# EAGLE design Addon - out8 16A - energy storage - 4TE - MID (EAGLE 6.3)
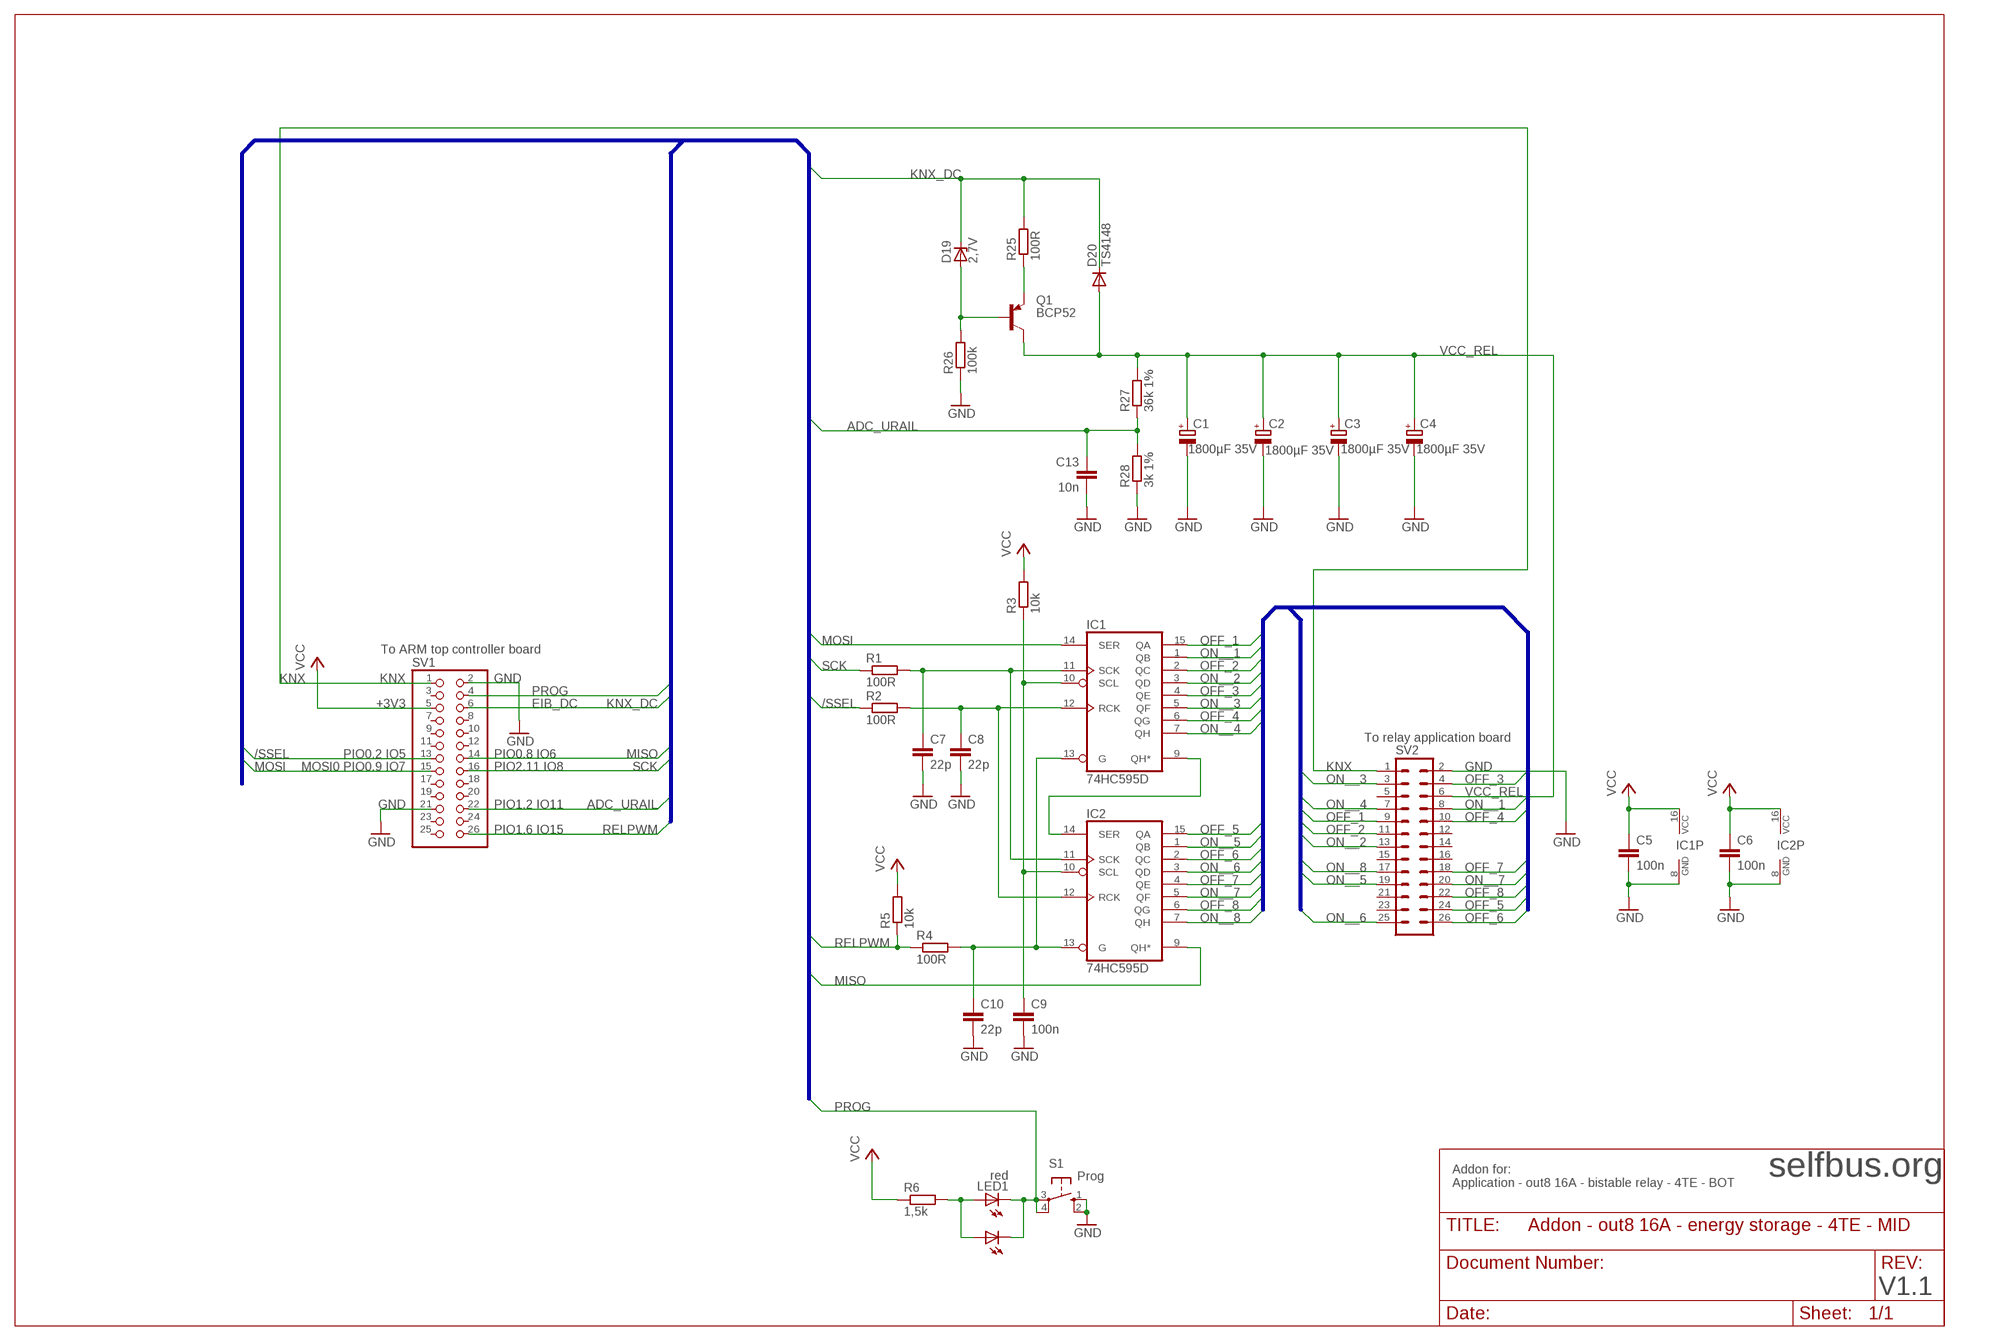
[diagram p0: schematic, sheet 1]

## Parts
C1  1800µF 35V  CPOL-EUE5-13-30  [E5-13-30]
C2  1800µF 35V  CPOL-EUE5-13-30  [E5-13-30]
C3  1800µF 35V  CPOL-EUE5-13-30  [E5-13-30]
C4  1800µF 35V  CPOL-EUE5-13-30  [E5-13-30]
C5  100n  C-EUC0805M  [R0805M]
C6  100n  C-EUC0805M  [R0805M]
C7  22p  C-EUC0805M  [R0805M]
C8  22p  C-EUC0805M  [R0805M]
C9  100n  C-EUC0805M  [R0805M]
C10  22p  C-EUC0805M  [R0805M]
C13  10n  C-EUC0805M  [R0805M]
D19  2,7V  ZENER-DIODESOT23  [SOT23]
D20  TS4148  DIODE-D0805  [D0805]
IC1  74HC595D  [SO16]
IC2  74HC595D  [SO16]
LED1  red  LED3MM  [LED3MM]
LED2  LG_T679-E1F1-1  [PLCC2]
Q1  BCP52  FZT753SMD  [SOT223]
R1  100R  R-EU_R0805M  [R0805M]
R2  100R  R-EU_R0805M  [R0805M]
R3  10k  R-EU_R0805M  [R0805M]
R4  100R  R-EU_R0805M  [R0805M]
R5  10k  R-EU_R0805M  [R0805M]
R6  1,5k  R-EU_R0805M  [R0805M]
R25  100R  R-EU_R0805M  [R0805M]
R26  100k  R-EU_R0805M  [R0805M]
R27  36k 1%  R-EU_R0805M  [R0805M]
R28  3k 1%  R-EU_R0805M  [R0805M]
S1  Prog  10-XX  [B3F-10XX]
SV1  B  PINHD-2X13SMD  [2X13SMD]
SV2  A  ML26  [ML26]

## Nets
/SSEL: R2.1 SV1.13
ADC_URAIL: C13.1 R27.1 R28.2 SV1.22
GND: C1.- C2.- C3.- C4.- C5.2 C6.2 C7.2 C8.2 C9.2 C10.2 C13.2 IC1.8(GND) IC2.8(GND) R26.1 R28.1 S1.1(S) S1.2(S1) SV1.2 SV1.21 SV2.2
KNX: SV1.1 SV2.1
KNX_DC: D19.3(C) D20.C R25.2 SV1.6
MISO: IC2.9(QH*) SV1.14
MOSI: IC1.14(SER) SV1.15
N$1: D19.1(A) Q1.1(B) R26.2
N$2: IC1.9(QH*) IC2.14(SER)
N$3: C7.1 IC1.11(SCK) IC2.11(SCK) R1.2
N$4: C8.1 IC1.12(RCK) IC2.12(RCK) R2.2
N$5: LED1.A LED2.A R6.2
N$6: Q1.3(E) R25.1
N$7: C10.1 IC1.13(G) IC2.13(G) R4.2
N$37: C9.1 IC1.10(SCL) IC2.10(SCL) R3.1
OFF_1: IC1.15(QA) SV2.9
OFF_2: IC1.2(QC) SV2.11
OFF_3: IC1.4(QE) SV2.4
OFF_4: IC1.6(QG) SV2.10
OFF_5: IC2.15(QA) SV2.24
OFF_6: IC2.2(QC) SV2.26
OFF_7: IC2.4(QE) SV2.18
OFF_8: IC2.6(QG) SV2.22
ON__1: IC1.1(QB) SV2.8
ON__2: IC1.3(QD) SV2.13
ON__3: IC1.5(QF) SV2.3
ON__4: IC1.7(QH) SV2.7
ON__5: IC2.1(QB) SV2.19
ON__6: IC2.3(QD) SV2.25
ON__7: IC2.5(QF) SV2.20
ON__8: IC2.7(QH) SV2.17
PROG: LED1.K(C) LED2.C S1.3(P) S1.4(P1) SV1.4
RELPWM: R4.1 R5.1 SV1.26
SCK: R1.1 SV1.16
VCC: C5.1 C6.1 IC1.16(VCC) IC2.16(VCC) R3.2 R5.2 R6.1 SV1.5
VCC_REL: C1.+ C2.+ C3.+ C4.+ D20.A Q1.2(C) Q1.4(C) R27.2 SV2.6
Unconnected: SV1.3 SV1.7 SV1.8 SV1.9 SV1.10 SV1.11 SV1.12 SV1.17 SV1.18 SV1.19 SV1.20 SV1.23 SV1.24 SV1.25 SV2.5 SV2.12 SV2.14 SV2.15 SV2.16 SV2.21 SV2.23

## Buses
ON__[1..8],OFF_[1..8]
/SSEL,ADC_URAIL,KNX_DC,MISO,MOSI,PROG,RELPWM,SCK

## Notes on the sheet
- To ARM top controller board
- KNX | GND
- +3V3 | EIB_DC
- To relay application board
- PIO0.2 IO5 | PIO0.8 IO6
- MOSI0 PIO0.9 IO7 | PIO2.11 IO8
- GND | PIO1.2 IO11
- PIO1.6 IO15
- selfbus.org
- Addon for:
  Application - out8 16A - bistable relay - 4TE - BOT
- V1.1

## Library data of the parts
C1-C4 = rcl:CPOL-EU: POLARIZED CAPACITOR, European symbol
C5-C10 C13 = rcl:C-EU: CAPACITOR, European symbol
D19 = diode:ZENER-DIODE: Z-Diode
D20 = diode:DIODE-: DIODE
IC1 IC2 = 74xx-eu:74*595: 8-bit SHIFT REGISTER, output latch
LED1 = led:LED: LED OSRAM: - CHIPLED LG R971, LG N971, LY N971, LG Q971, LY Q971, LO R971, LY R971 LH N974, LH R974 LS Q976, LO Q976, LY Q976 LO Q996 - Hyper CHIPLED LW Q18S LB Q993, LB Q99A, LB R99A - SideLED LS A670, LO A670, LY A670, LG A670, LP A670 LB A673, LV A673, LT A673, LW A673 LH A674 LY A675 LS A676, LA A676, LO A676, LY A676, LW A676 LS A679, LY A679, LG A679 - Hyper Micro SIDELED® LS Y876, LA Y876, LO Y876, LY Y876 LT Y87S - SmartLED LW L88C, LW L88S LB L89C, LB L89S, LG L890 LS L89K, LO L89K, LY L89K LS L896, LA L896, LO L896, LY L896 - TOPLED LS T670, LO T670, LY T670, LG T670, LP T670 LSG T670, LSP T670, LSY T670, LOP T670, LYG T670 LG T671, LOG T671, LSG T671 LB T673, LV T673, LT T673, LW T673 LH T674 LS T676, LA T676, LO T676, LY T676, LB T676, LH T676, LSB T676, LW T676 LB T67C, LV T67C, LT T67C, LS T67K, LO T67K, LY T67K, LW E67C LS E67B, LA E67B, LO E67B, LY E67B, LB E67C, LV E67C, LT E67C LW T67C LS T679, LY T679, LG T679 LS T770, LO T770, LY T770, LG T770, LP T770 LB T773, LV T773, LT T773, LW T773 LH T774 LS E675, LA E675, LY E675, LS T675 LS T776, LA T776, LO T776, LY T776, LB T776 LHGB T686 LT T68C, LB T68C - Hyper Mini TOPLED® LB M676 - Mini TOPLED Santana® LG M470 LS M47K, LO M47K, LY M47K Source: http://www.osram.convergy.de LUXEON: - LUMILED® LXK2-PW12-R00, LXK2-PW12-S00, LXK2-PW14-U00, LXK2-PW14-V00 LXK2-PM12-R00, LXK2-PM12-S00, LXK2-PM14-U00 LXK2-PE12-Q00, LXK2-PE12-R00, LXK2-PE12-S00, LXK2-PE14-T00, LXK2-PE14-U00 LXK2-PB12-K00, LXK2-PB12-L00, LXK2-PB12-M00, LXK2-PB14-N00, LXK2-PB14-P00, LXK2-PB14-Q00 LXK2-PR12-L00, LXK2-PR12-M00, LXK2-PR14-Q00, LXK2-PR14-R00 LXK2-PD12-Q00, LXK2-PD12-R00, LXK2-PD12-S00 LXK2-PH12-R00, LXK2-PH12-S00 LXK2-PL12-P00, LXK2-PL12-Q00, LXK2-PL12-R00 Source: www.luxeon.com KINGBRIGHT: KA-3528ASYC Source: www.kingbright.com
LED2 = led:*_T679-?-1: LC TOPLED® Low Current LED Source: http://catalog.osram-os.com .. LG_LS_LY_T679_OBS.pdf; COLOR: green
Q1 = transistor-pnp:FZT753SMD: PNP Transistor
R1-R6 R25-R28 = rcl:R-EU_: RESISTOR, European symbol
S1 = switch-omron:10-XX: OMRON SWITCH
SV1 = pinhead:PINHD-2X13: PIN HEADER
SV2 = con-harting-ml:ML26: HARTING; OC_FARNELL: unknown; OC_NEWARK: unknown

## Board
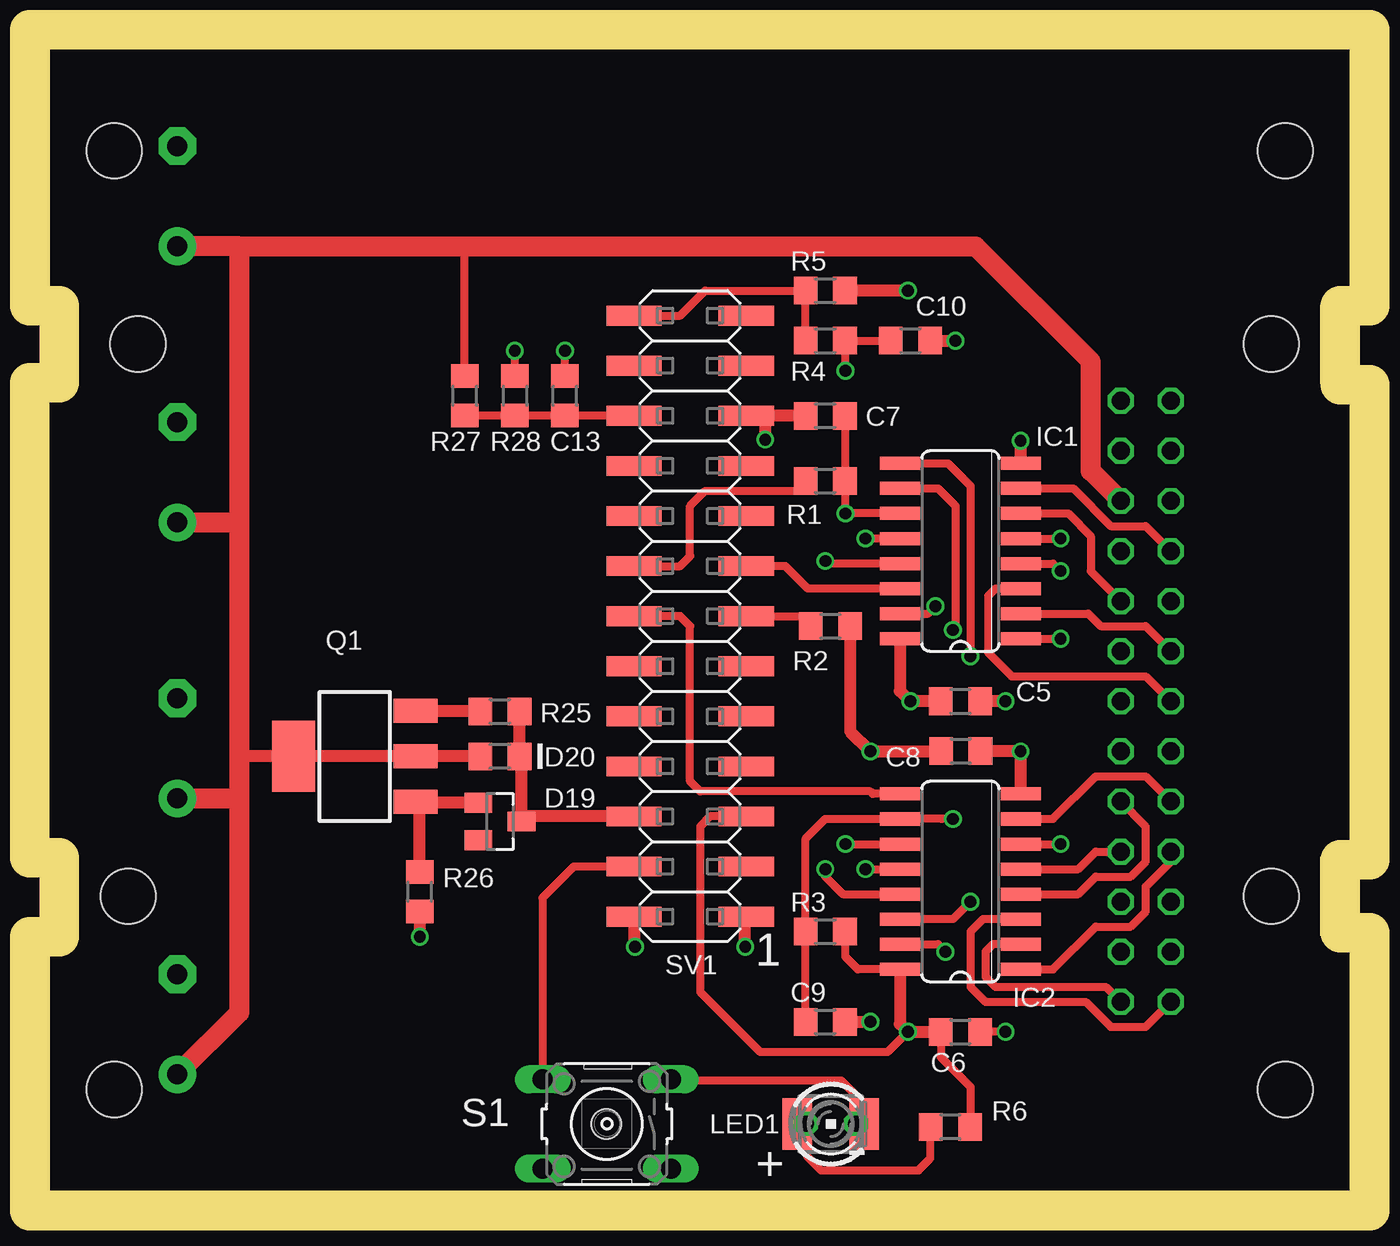
[diagram p1: board, top side]
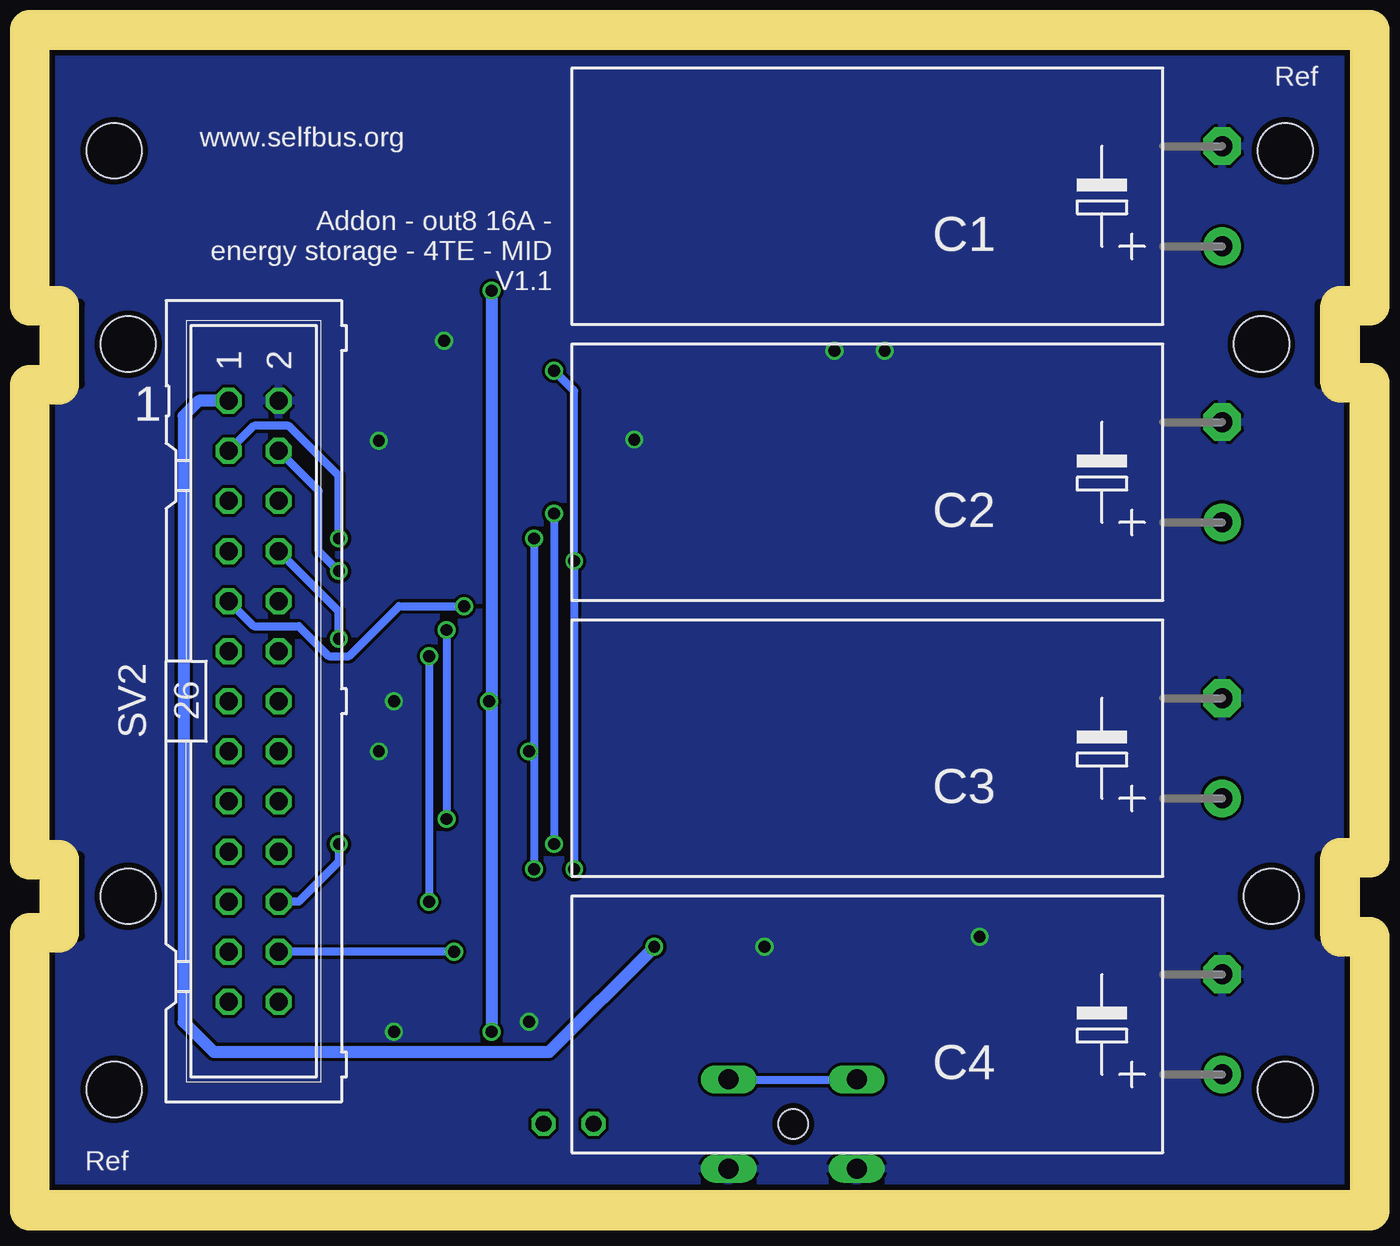
[diagram p2: board, bottom side, seen from below]

Size 66 x 57.9 mm. Coordinates in mm from the lower left corner, seen from the top.
Outline: 0,0 66,0 66,12.95 64.5,12.95 64.5,16.95 66,16.95 66,40.95 64.5,40.95 64.5,44.95 66,44.95 66,57.9 0,57.9 0,44.95 1.5,44.95 1.5,40.95 0,40.95 0,16.95 1.5,16.95 1.5,12.95 0,12.95 0,0
Copper layers (1*16): Top 0.035mm / dielectric 1.5mm / Bottom 0.035mm
Design rules "default": minimum track width 0.16mm, minimum drill 0.3mm, track to track 0.16mm, track to pad 0.16mm, pad to pad 0.16mm, via to via 0.16mm, smd to smd 0.16mm, copper to edge 0.3mm, drill to drill 0.2mm, minimum pad ring 0.2mm, minimum via ring 0.15mm, stop-mask expansion 0.075mm, vias tented up to drill 12mil, thermal gap 0.15mm
Holes 2.8 mm at 62.7,52.75 3.3,52.75 3.3,5.15 62.7,5.15 4,14.95 4.5,42.95 62,42.95 62,14.95
Holes 1.5 mm at 28.27,3.4
Milling: 20 lines

### Footprints (pad centres in the part's own frame; a part is rotated, then mirrored left to right if it is on the bottom)
E5-13-30 = drill 1.016 pad 1.905: + -2.54,0 | drill 1.016 pad 1.905 octagon: - 2.54,0
R0805M = smd 1.2 x 1.4: 1 -1,0; 2 1,0
SOT23 = smd 1 x 1.4: 1 -0.95,-1.1; 2 0.95,-1.1; 3 0,1.1
D0805 = smd 1.2 x 1.4: A 1,0; C -1,0
SO16 = smd 0.66 x 2.032: 1 -4.445,-3.073; 2 -3.175,-3.073; 3 -1.905,-3.073; 4 -0.635,-3.073; 5 0.635,-3.073; 6 1.905,-3.073; 7 3.175,-3.073; 8 4.445,-3.073; 9 4.445,3.073; 10 3.175,3.073; 11 1.905,3.073; 12 0.635,3.073; 13 -0.635,3.073; 14 -1.905,3.073; 15 -3.175,3.073; 16 -4.445,3.073
LED3MM = drill 0.813 octagon: A -1.27,0; K 1.27,0
PLCC2 = smd 2.6 x 1.5: A 0,1.7; C 0,-1.7
SOT223 = smd 1.219 x 2.235: 1 -2.311,-3.099; 2 0,-3.099; 3 2.311,-3.099 | smd 3.6 x 2.2: 4 0,3.099
B3F-10XX = drill 1.016 long: 1 -3.251,2.261; 2 3.251,2.261; 3 -3.251,-2.261; 4 3.251,-2.261
2X13SMD = smd 1 x 2.8: 1 -15.24,-2.85; 2 -15.24,2.85; 3 -12.7,-2.85; 4 -12.7,2.85; 5 -10.16,-2.85; 6 -10.16,2.85; 7 -7.62,-2.85; 8 -7.62,2.85; 9 -5.08,-2.85; 10 -5.08,2.85; 11 -2.54,-2.85; 12 -2.54,2.85; 13 0,-2.85; 14 0,2.85; 15 2.54,-2.85; 16 2.54,2.85; 17 5.08,-2.85; 18 5.08,2.85; 19 7.62,-2.85; 20 7.62,2.85; 21 10.16,-2.85; 22 10.16,2.85; 23 12.7,-2.85; 24 12.7,2.85; 25 15.24,-2.85; 26 15.24,2.85
ML26 = drill 0.914 octagon: 1 -15.24,-1.27; 2 -15.24,1.27; 3 -12.7,-1.27; 4 -12.7,1.27; 5 -10.16,-1.27; 6 -10.16,1.27; 7 -7.62,-1.27; 8 -7.62,1.27; 9 -5.08,-1.27; 10 -5.08,1.27; 11 -2.54,-1.27; 12 -2.54,1.27; 13 0,-1.27; 14 0,1.27; 15 2.54,-1.27; 16 2.54,1.27; 17 5.08,-1.27; 18 5.08,1.27; 19 7.62,-1.27; 20 7.62,1.27; 21 10.16,-1.27; 22 10.16,1.27; 23 12.7,-1.27; 24 12.7,1.27; 25 15.24,-1.27; 26 15.24,1.27

### Placement (x,y rotation side)
C1  6.5,50.45 90 bottom
C2  6.5,36.45 90 bottom
C3  6.5,22.45 90 bottom
C4  6.5,8.45 90 bottom
C5  46.23,24.83 0 top
C6  46.23,8.07 0 top
C7  39.37,39.31 180 top
C8  46.24,22.32 0 top
C9  39.37,8.58 0 top
C10  43.69,43.12 0 top
C13  26.16,40.33 90 top
D19  22.86,18.74 270 top
D20  22.86,22.04 180 top
IC1  46.23,32.45 90 top
IC2  46.23,15.69 90 top
LED1  39.65,3.4 0 top
LED2  39.65,3.4 90 top
Q1  15.49,22.04 90 top
R1  39.37,36.01 0 top
R2  39.62,28.64 0 top
R3  39.37,13.15 0 top
R4  39.37,43.12 0 top
R5  39.37,45.66 0 top
R6  45.72,3.24 180 top
R25  22.86,24.33 0 top
R26  18.8,15.18 90 top
R27  21.08,40.33 90 top
R28  23.62,40.33 270 top
S1  28.29,3.4 180 top
SV1  32.51,29.15 90 top
SV2  55.63,24.83 270 bottom

### Tracks (layer width: path | path; a pad name or v marks a point on that pad's centre or on a via)
/SSEL
  Top 0.406: SV1.13 38.12,29.15 R2.1
ADC_URAIL
  Top 0.406: SV1.22 26.18,39.31 | 26.18,39.31 C13.1 | 26.18,39.31 23.64,39.31 R28.2 R27.1
GND  (via drill 0.6)
  Top 0.406: R28.1 v23.62,42.61 | C13.2 v26.16,42.61 | v48.51,8.07 C6.2
  Top 0.61: C9.2 v41.66,8.58 | SV1.2 29.66,12.44 v29.72,12.39 | C8.2 49.25,22.32 v49.28,22.29 49.28,20.16 IC2.8 | C10.2 v45.97,43.12 | v36.32,38.1 36.32,39.06 36.07,39.31 | 36.07,39.31 SV1.21 | R26.1 v18.8,12.9 | C7.2 36.07,39.31 | v48.51,24.83 C5.2 | IC1.8 49.3,38.02 v49.28,38.04
  pour Bottom: 0,-0.06 66.04,-0.06 66.04,58.11 0,58.11
KNX  (via drill 0.6)
  Top 0.61: v35.31,12.39 35.31,13.86 SV1.1
  Bottom 0.61: SV2.1 58.42,40.07 59.18,39.31 59.18,8.58 57.66,7.05 40.64,7.05 v35.31,12.39
KNX_DC
  Top 0.61: SV1.6 24.21,18.99 D19.3 23.96,21.94 D20.C R25.2
MISO
  Top 0.406: 43.18,20.16 IC2.9 41.78,20.14 41.66,20.26 33.02,20.26 32.51,20.77 32.51,28.64 32,29.15 SV1.14
MOSI
  Top 0.406: IC1.14 38.48,30.55 37.34,31.69 SV1.15
N$1
  Top 0.61: D19.1 18.63,19.69 Q1.1 18.8,19.52 R26.2
N$2  (via drill 0.6)
  Top 0.406: IC1.9 45.59,36.9 46.74,35.76 v46.74,27.12 | IC2.14 45.85,13.79 v46.74,14.67
  Bottom 0.406: v46.74,27.12 v46.74,14.67
N$3  (via drill 0.6)
  Top 0.406: IC1.11 v40.39,34.36 40.37,34.38 R1.2 C7.1 | v40.39,17.59 IC2.11
  Bottom 0.406: v40.39,34.36 v40.39,17.59
N$4  (via drill 0.6)
  Top 0.406: IC1.12 v41.4,33.09 | v41.4,16.32 IC2.12
  Top 0.61: R2.2 40.62,23.33 v41.66,22.29 45.22,22.29 C8.1
  Bottom 0.406: v41.4,33.09 41.4,22.29 | 41.4,22.29 v41.4,16.32 | v41.66,22.29 41.4,22.29
N$5
  Top 0: LED2.A 37.95,3.35 38.4,2.91 38.4,3.2 38.45,3.25
  Top 0.406: LED1.A 38.4,2.91 | 44.7,3.23 R6.2 44.7,3.22 44.7,1.65 44.1,1.05 39.15,1.05 38.45,1.75 38.45,3.25
N$6
  Top 0.61: R25.1 18.62,24.33 Q1.3
N$7  (via drill 0.6)
  Top 0.406: v39.37,16.32 39.37,15.94 40.26,15.05 IC2.13 | v40.39,41.6 40.39,43.11 R4.2 C10.1 | IC1.13 39.5,31.82 v39.37,31.95
  Bottom 0.406: v39.37,16.32 v39.37,31.95 39.37,40.58 v40.39,41.6
N$37  (via drill 0.6)
  Top 0.406: IC1.10 45.09,35.63 45.97,34.74 45.97,28.58 v45.85,28.45 | 45.28,18.86 IC2.10 | v45.85,18.86 IC2.10 | C9.1 R3.1 38.37,17.86 39.37,18.86 IC2.10
  Bottom 0.406: v45.85,28.45 v45.85,18.86
OFF_1  (via drill 0.6)
  Top 0.406: IC1.15 44.58,29.28 v44.96,29.66
  Bottom 0.406: SV2.9 55.63,28.64 53.34,28.64 51.82,27.12 50.8,27.12 48.26,29.66 v44.96,29.66
OFF_2
  Top 0.406: IC1.2 52.7,29.28 53.34,28.64 55.63,28.64 SV2.11
OFF_3  (via drill 0.6)
  Top 0.406: IC1.4 50.93,31.82 v51.31,31.44
  Bottom 0.406: SV2.4 52.32,35.5 52.32,32.45 v51.31,31.44
OFF_4
  Top 0.406: IC1.6 51.69,34.36 52.83,33.22 52.83,31.44 SV2.10
OFF_5  (via drill 0.6)
  Top 0.406: IC2.15 45.09,12.52 v45.47,12.13
  Bottom 0.406: v45.47,12.13 SV2.24
OFF_6
  Top 0.406: SV2.26 53.59,10.36 48.01,10.36 47.5,10.86 47.5,12.13 47.88,12.52 IC2.2
OFF_7
  Top 0.406: IC2.4 52.2,15.05 53.09,15.94 54.86,15.94 55.63,16.71 55.63,18.48 SV2.18
OFF_8  (via drill 0.6)
  Top 0.406: IC2.6 v51.31,17.59
  Bottom 0.406: v51.31,17.59 51.31,16.71 53.34,14.67 SV2.22
ON__1  (via drill 0.6)
  Top 0.406: IC1.1 v51.31,28.01
  Bottom 0.406: v51.31,28.01 51.31,29.41 SV2.8
ON__2
  Top 0.406: IC1.3 48.01,30.55 47.62,30.17 47.62,27.31 48.83,26.1 55.63,26.1 SV2.13
ON__3  (via drill 0.6)
  Top 0.406: IC1.5 v51.31,33.09
  Bottom 0.406: v51.31,33.09 51.31,36.26 53.85,38.8 55.63,38.8 SV2.3
ON__4
  Top 0.406: IC1.7 51.94,35.63 53.85,33.72 55.63,33.72 SV2.7
ON__5
  Top 0.406: IC2.1 50.93,11.24 53.09,13.4 54.86,13.4 55.63,14.17 55.63,15.44 56.9,16.71 SV2.19
ON__6
  Top 0.406: IC2.3 47.37,13.79 46.74,13.15 46.74,10.36 47.5,9.59 52.58,9.59 53.85,8.32 55.63,8.32 SV2.25
ON__7
  Top 0.406: IC2.5 52.2,16.32 53.09,17.21 SV2.20
ON__8
  Top 0.406: IC2.7 50.93,18.86 53.09,21.02 55.63,21.02 SV2.17
PROG  (via drill 0.6)
  Top 0: 40.96,3.32 41.27,3.32 LED2.C
  Top 0.406: LED1.K 40.96,3.32 40.96,4.83 40.19,5.6 31.54,5.6 S1.3 v31.52,5.62 | SV1.4 26.61,16.45 25.02,14.86 v25.02,5.62 S1.4
  Bottom 0.406: v25.02,5.62 v31.52,5.62
RELPWM
  Top 0.406: R4.1 R5.1 33.27,45.66 32,44.39 SV1.26
SCK
  Top 0.406: SV1.16 32,31.69 32.51,32.2 32.51,34.74 33.27,35.5 37.86,35.5 R1.1
VCC  (via drill 0.6)
  Top 0.406: IC2.16 41.02,11.24 40.39,11.88 40.39,13.13 R3.2 | SV1.5 33.53,18.99 33.02,18.48 33.02,10.1 36.07,7.05 42.55,7.05 v43.56,8.07 | C6.1 45.23,6.78 46.74,5.28 46.74,3.26 R6.1
  Top 0.61: v43.56,45.66 R5.2 | C6.1 v43.56,8.07 43.16,8.48 IC2.16 | C5.1 v43.69,24.83 43.16,25.37 IC1.16
  Bottom 0.406: v43.69,24.83 43.56,24.83
  Bottom 0.61: v43.56,45.66 43.56,24.83 v43.56,8.07
VCC_REL
  Top 0.406: R27.2 21.08,47.91
  Top 0.61: 9.65,32.45 9.65,32.71 | D20.A Q1.2 Q1.4 9.91,22.04 9.65,22.29
  Top 1.016: 9.65,19.9 9.65,9.06 C4.+ | 9.65,19.9 9.65,22.29 9.65,32.71 9.65,34.2 | 9.65,34.2 9.65,47.91 | 9.65,47.91 21.08,47.91 46.99,47.91 52.83,42.07 52.83,36.52 SV2.6 | 9.65,47.91 C1.+ | C2.+ 9.36,33.91 9.65,34.2 | C3.+ 9.64,19.91 9.65,19.9

### Text on the board
tPlace: 1 | +
bPlace: Ref | 1 | Ref
bNames: www.selfbus.org | Addon - out8 16A - / energy storage - 4TE - MID / V1.1